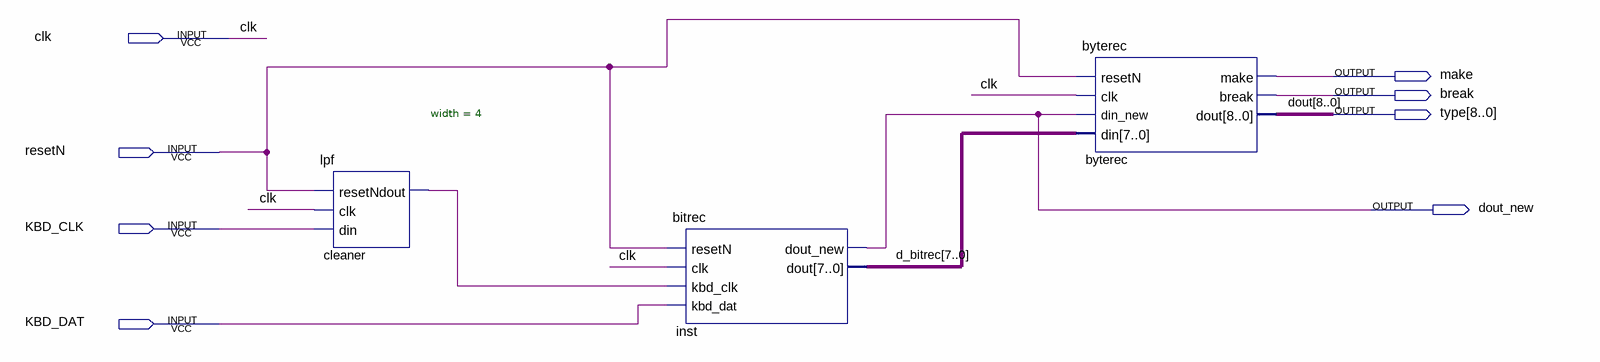
[diagram p0: schematic sheet]
// Quartus schematic KBDINTF.bdf as structural Verilog: 3 symbols, 8 pins
module KBDINTF (
  input  clk,
  input  resetN,
  input  KBD_CLK,
  input  KBD_DAT,
  output make,
  output \break ,
  output [8:0] \type ,
  output dout_new
);

  wire cleaner_dout;
  wire [7:0] d_bitrec;

  lpf #(.width(4)) cleaner (.resetN(resetN), .clk(clk), .din(KBD_CLK), .dout(cleaner_dout));
  bitrec inst (
    .resetN(resetN), .clk(clk), .kbd_clk(cleaner_dout), .kbd_dat(KBD_DAT), .dout_new(dout_new),
    .dout(d_bitrec));
  byterec byterec (
    .resetN(resetN), .clk(clk), .din_new(dout_new), .din(d_bitrec), .make(make), .\break (\break ),
    .dout(\type ));

  // Other names for the same wires on the sheet: dout[8:0] = \type 
endmodule
